# EAGLE design facetHound_inputs_chassis_v12 (EAGLE 9.6.2)

## Sheet 1 of 2
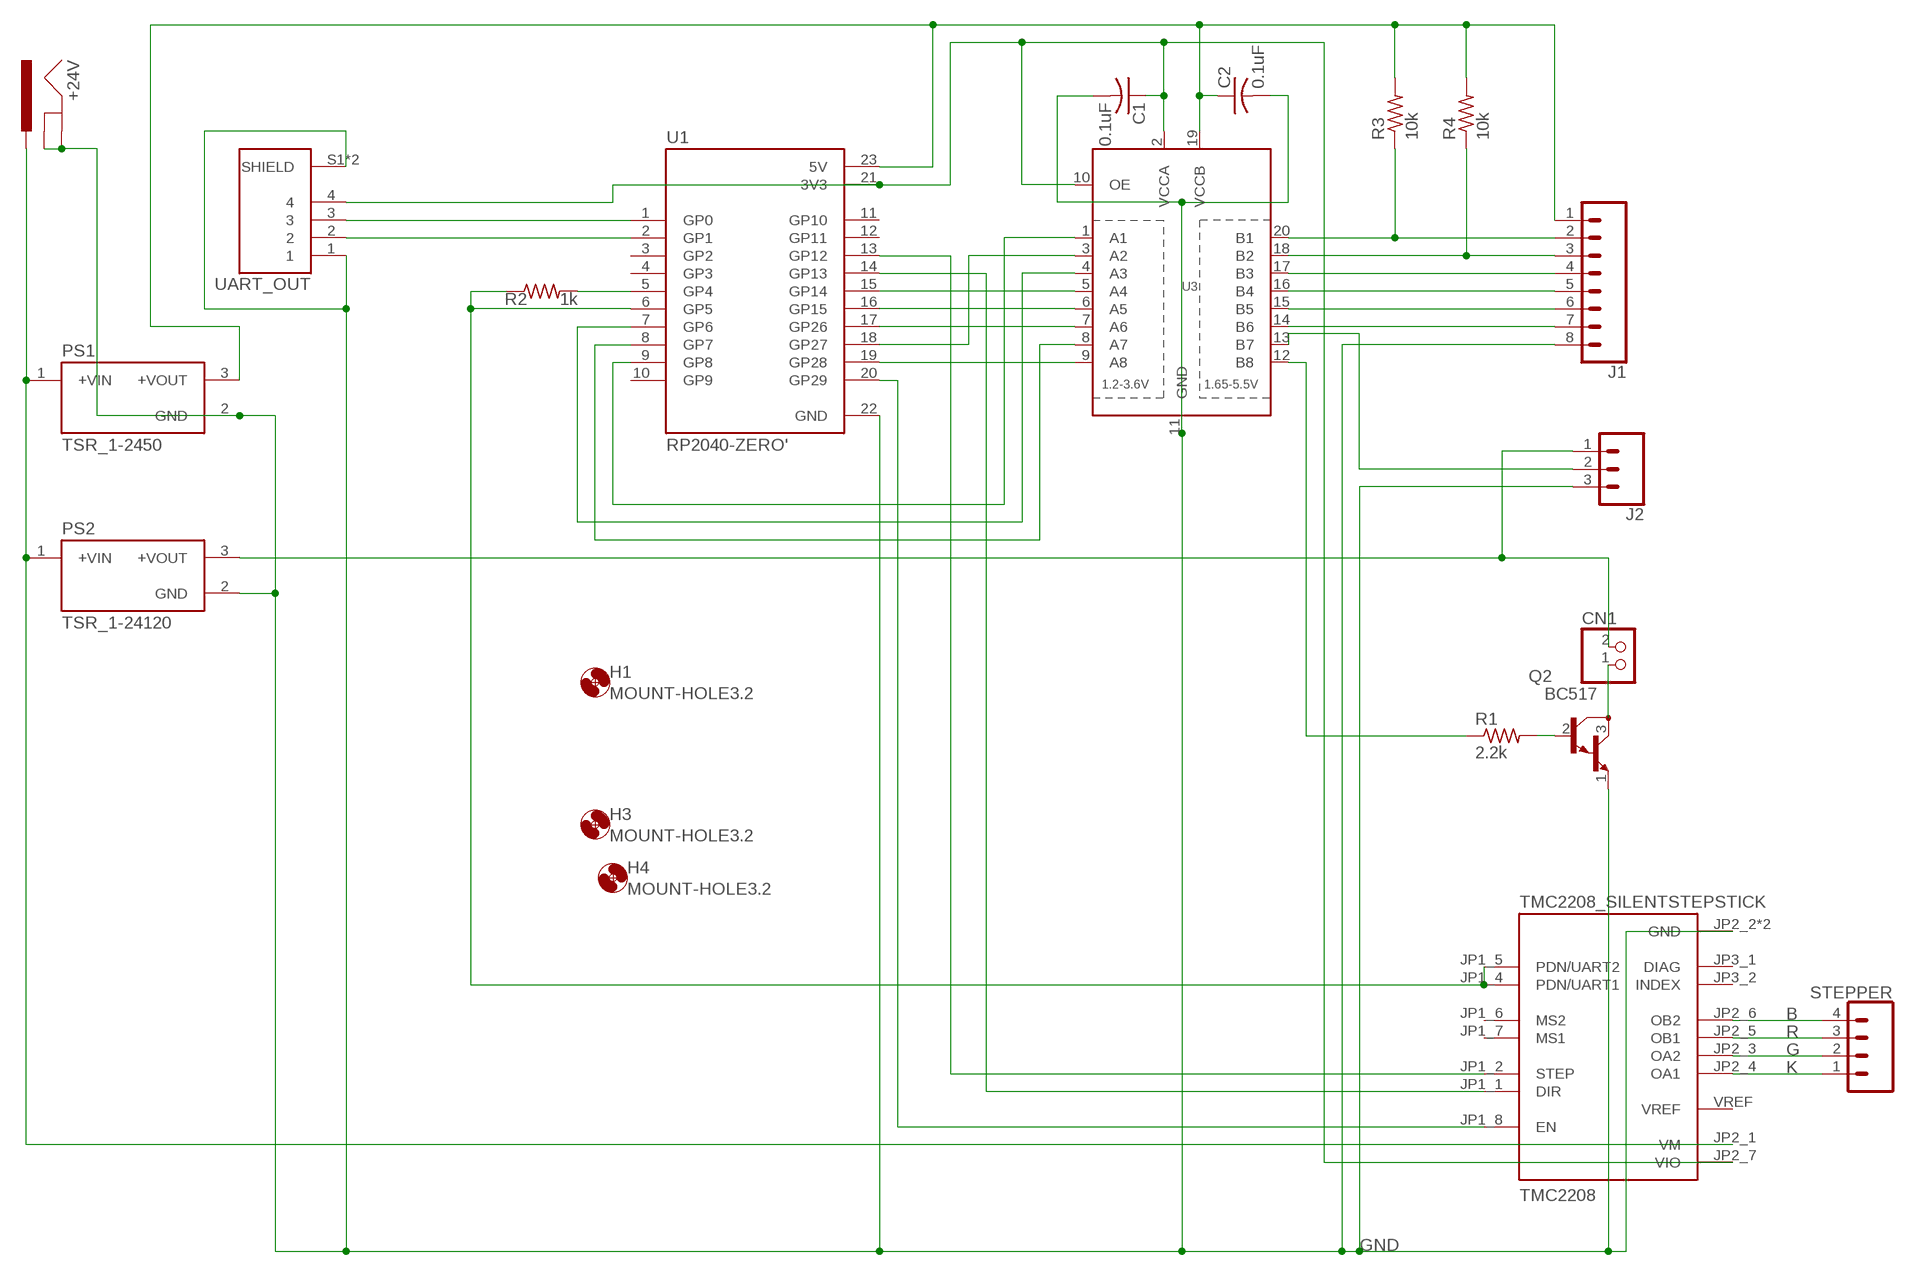
[diagram p0: schematic, sheet 1]

### Parts
+24V  POWER_JACKPOWER_JACK_SLOT  [POWER_JACK_PTH_SLOT]
C1  0.1uF  C-USC1206  [C1206]
C2  0.1uF  C-USC1206  [C1206]
CN1  JST_2PIN-THM-RA  [JST-PH-2-THM-RA]
H1  MOUNT-HOLE3.2  [3,2]
H3  MOUNT-HOLE3.2  [3,2]
H4  MOUNT-HOLE3.2  [3,2]
J1  CONN_08LONGPADS  [1X08_LONGPADS]
J2  CONN_03SCREW  [SCREWTERMINAL-3.5MM-3]
PS1  TSR_1-2450  [CONV_TSR_1-2450]
PS2  TSR_1-24120  TSR_1-2450  [CONV_TSR_1-2450]
Q2  BC517  [TO92]
R1  2.2k  R-US_M1206  [M1206]
R2  1k  R-US_R1206  [R1206]
R3  10k  R-US_M1206  [M1206]
R4  10k  R-US_M1206  [M1206]
STEPPER  CONN_04JST-PTH  [JST-4-PTH]
TMC2208  TMC2208_SILENTSTEPSTICK  [MODULE_TMC2208_SILENTSTEPSTICK]
U1  RP2040-ZERO'  [MODULE_RP2040-ZERO]
U3  TXB0108PWR  [TSSOP20]
UART_OUT  S4B-ZR-SM4A-TF(LF)(SN)  [JST_S4B-ZR-SM4A-TF(LF)(SN)]

### Nets
B: STEPPER.4 TMC2208.JP2_6(OB2)
G: STEPPER.2 TMC2208.JP2_3(OA2)
GND: +24V.GND +24V.GNDBREAK C1.2 C2.2 J1.8 J2.3 PS1.2(GND) PS2.2(GND) Q2.1(E) TMC2208.JP2_2(GND) TMC2208.JP2_8(GND) U1.22(GND) U3.11(GND) UART_OUT.1 UART_OUT.S1(SHIELD) UART_OUT.S2(SHIELD)
K: STEPPER.1 TMC2208.JP2_4(OA1)
N$1: R2.1 TMC2208.JP1_4(PDN/UART1) TMC2208.JP1_5(PDN/UART2) U1.6(GP5)
N$3: R2.2 U1.5(GP4)
N$4: C1.1 TMC2208.JP2_7(VIO) U1.21(3V3) U3.2(VCCA) U3.10(OE) UART_OUT.4
N$5: TMC2208.JP1_1(DIR) U1.14(GP13)
N$6: TMC2208.JP1_2(STEP) U1.13(GP12)
N$7: R1.1 U3.12(B8)
N$8: Q2.2(B) R1.2
N$9: C2.1 J1.1 PS1.3(+VOUT) R3.2 R4.2 U1.23(5V) U3.19(VCCB)
N$10: U1.2(GP1) UART_OUT.2
N$11: U1.1(GP0) UART_OUT.3
N$12: CN1.2 J2.1 PS2.3(+VOUT)
N$13: J1.2 R3.1 U3.20(B1)
N$14: J1.3 R4.1 U3.18(B2)
N$15: J1.4 U3.17(B3)
N$16: J1.5 U3.16(B4)
N$17: J1.6 U3.15(B5)
N$18: J1.7 U3.14(B6)
N$20: TMC2208.JP1_8(EN) U1.20(GP29)
N$21: +24V.PWR PS1.1(+VIN) PS2.1(+VIN) TMC2208.JP2_1(VM)
N$22: J2.2 U3.13(B7)
N$23: U1.9(GP8) U3.1(A1)
N$24: CN1.1 Q2.3(C)
N$25: U1.18(GP27) U3.3(A2)
N$26: U1.7(GP6) U3.4(A3)
N$27: U1.15(GP14) U3.5(A4)
N$28: U1.16(GP15) U3.6(A5)
N$29: U1.17(GP26) U3.7(A6)
N$30: U1.8(GP7) U3.8(A7)
N$31: U1.19(GP28) U3.9(A8)
R: STEPPER.3 TMC2208.JP2_5(OB1)
Unconnected: TMC2208.JP1_6(MS2) TMC2208.JP1_7(MS1) TMC2208.JP3_1(DIAG) TMC2208.JP3_2(INDEX) TMC2208.VREF U1.3(GP2) U1.4(GP3) U1.10(GP9) U1.11(GP10) U1.12(GP11)

## Sheet 2 of 2

## Library data of the parts
+24V = SparkFun-Connectors:POWER_JACK: Power Jack Connector This is the standard 5.5mm barrel jack for power. The PTH is the most common, proven, reliable, footprint. The Slot footprint only works if the mill layer is transmitted to the PCB fab house so be warned. Here are the connectors we sell at SparkFun: DC Barrel Power Jack/Connector <https://www.sparkfun.com/products/119> (PRT-00119) DC Barrel Power Jack/Connector (SMD) <https://www.sparkfun.com/products/12748> (PRT-12748) DC Barrel Jack Adapter - Breadboard Compatible <https://www.sparkfun.com/products/10811> (PRT-10811) It is used on this SparkFun product (and many, many others): SparkFun RedBoard - Programmed with Arduino <https://www.sparkfun.com/products/12757> (DEV-12757) Also, if you need a mating power supply or connector, please check these out: Wall Adapter Power Supply - 9VDC 650mA <https://www.sparkfun.com/products/298> (TOL-00298) DC Barrel Jack Adapter - Male <https://www.sparkfun.com/products/10287> (PRT-10287); PROD_ID: CONN-08197
C1 C2 = adafruit:C-US: CAPACITOR, American symbol
CN1 = adafruit:JST_2PIN: JST 2-Pin Connectors of various flavors SMT-RA (S2B-PH-SM4) 4UConnector #17311 SMT (B2B-PH-SM4) THM-RA (S2B-PH) THM (B2B-PH)
H1 H3 H4 = holes:MOUNT-HOLE: MOUNTING HOLE with drill center marker
J1 = SparkFun-Connectors:CONN_08: Multi connection point. Often used as Generic Header-pin footprint for 0.1 inch spaced/style header connections On any of the 0.1 inch spaced packages, you can populate with these: Break Away Headers - Straight <https://www.sparkfun.com/products/116> (PRT-00116) Break Away Male Headers - Right Angle <https://www.sparkfun.com/products/553> (PRT-00553) Female Headers <https://www.sparkfun.com/products/115> (PRT-00115) Break Away Headers - Machine Pin <https://www.sparkfun.com/products/117> (PRT-00117) Break Away Female Headers - Swiss Machine Pin <https://www.sparkfun.com/products/743> (PRT-00743) Arduino Stackable Header - 8 Pin <https://www.sparkfun.com/products/9279> (PRT-09279) For SCREWTERMINALS and SPRING TERMINALS visit here: Screw Terimnals on SparkFun.com <https://www.sparkfun.com/search/results?term=Screw+Terminals> (5mm/3.5mm/2.54mm spacing) This device is also useful as a general connection point to wire up your design to another part of your project. Our various solder wires solder well into these plated through hole pads. Hook-Up Wire - Assortment (Stranded, 22 AWG) <https://www.sparkfun.com/products/11375> (PRT-11375) Hook-Up Wire - Assortment (Solid Core, 22 AWG) <https://www.sparkfun.com/products/11367> (PRT-11367) View the entire wire category on our website here <https://www.sparkfun.com/categories/141> Special notes: Molex polarized connector foot print use with SKU : PRT-08231 with associated crimp pins and housings. 1MM SMD Version SKU: PRT-10208 NOTES ON THE VARIANTS LOCK and LOCK_LONGPADS... This footprint was designed to help hold the alignment of a through-hole component (i.e. 6-pin header) while soldering it into place. You may notice that each hole has been shifted either up or down by 0.005 of an inch from it's more standard position (which is a perfectly straight line). This slight alteration caused the pins (the squares in the middle) to touch the edges of the holes. Because they are alternating, it causes a "brace" to hold the component in place. 0.005 has proven to be the perfect amount of "off-center" position when using our standard breakaway headers. Although looks a little odd when you look at the bare footprint, once you have a header in there, the alteration is very hard to notice. Also,if you push a header all the way into place, it is covered up entirely on the bottom side.
J2 = SparkFun-Connectors:CONN_03: Multi connection point. Often used as Generic Header-pin footprint for 0.1 inch spaced/style header connections On any of the 0.1 inch spaced packages, you can populate with these: Break Away Headers - Straight <https://www.sparkfun.com/products/116> (PRT-00116) Break Away Male Headers - Right Angle <https://www.sparkfun.com/products/553> (PRT-00553) Female Headers <https://www.sparkfun.com/products/115> (PRT-00115) Break Away Headers - Machine Pin <https://www.sparkfun.com/products/117> (PRT-00117) Break Away Female Headers - Swiss Machine Pin <https://www.sparkfun.com/products/743> (PRT-00743) Stackable Header - 3 Pin (Female, 0.1") <https://www.sparkfun.com/products/13875> (PRT-13875) For SCREWTERMINALS and SPRING TERMINALS visit here: Screw Terimnals on SparkFun.com <https://www.sparkfun.com/search/results?term=Screw+Terminals> (5mm/3.5mm/2.54mm spacing) This device is also useful as a general connection point to wire up your design to another part of your project. Our various solder wires solder well into these plated through hole pads. Hook-Up Wire - Assortment (Stranded, 22 AWG) <https://www.sparkfun.com/products/11375> (PRT-11375) Hook-Up Wire - Assortment (Solid Core, 22 AWG) <https://www.sparkfun.com/products/11367> (PRT-11367) View the entire wire category on our website here <https://www.sparkfun.com/categories/141> Special notes: Molex polarized connector foot print use with SKU : PRT-08232 with associated crimp pins and housings.; PROD_ID: CONN-08288; SF_ID: PRT-08235
PS1 PS2 = TSR_1-2450:TSR_1-2450; MANUFACTURER: Traco Power; MAXIMUM_PACKAGE_HEIGHT: 10.6mm; PARTREV: Apr 27, 2020; STANDARD: Manufacturer Recommendations
Q2 = transistor-npn:BC517*: NPN Darlington Transistor
R1-R4 = adafruit:R-US_: RESISTOR, American symbol
STEPPER = SparkFun-Connectors:CONN_04: Multi connection point. Often used as Generic Header-pin footprint for 0.1 inch spaced/style header connections On any of the 0.1 inch spaced packages, you can populate with these: Break Away Headers - Straight <https://www.sparkfun.com/products/116> (PRT-00116) Break Away Male Headers - Right Angle <https://www.sparkfun.com/products/553> (PRT-00553) Female Headers <https://www.sparkfun.com/products/115> (PRT-00115) Break Away Headers - Machine Pin <https://www.sparkfun.com/products/117> (PRT-00117) Break Away Female Headers - Swiss Machine Pin <https://www.sparkfun.com/products/743> (PRT-00743) For SCREWTERMINALS and SPRING TERMINALS visit here: Screw Terimnals on SparkFun.com <https://www.sparkfun.com/search/results?term=Screw+Terminals> (5mm/3.5mm/2.54mm spacing) This device is also useful as a general connection point to wire up your design to another part of your project. Our various solder wires solder well into these plated through hole pads. Hook-Up Wire - Assortment (Stranded, 22 AWG) <https://www.sparkfun.com/products/11375> (PRT-11375) Hook-Up Wire - Assortment (Solid Core, 22 AWG) <https://www.sparkfun.com/products/11367> (PRT-11367) View the entire wire category on our website here <https://www.sparkfun.com/categories/141> Special notes: Molex polarized connector foot print use with SKU : PRT-08231 with associated crimp pins and housings. 1MM SMD Version SKU: PRT-10208; PROD_ID: WIRE-13531; SF_ID: PRT-09916
TMC2208 = TMC2208_SILENTSTEPSTICK:TMC2208_SILENTSTEPSTICK: Check availability <https://pricing.snapeda.com/parts/TMC2208%20SILENTSTEPSTICK/Trinamic%20Motion/view-part?ref=eda>; AVAILABILITY: In Stock; CHECK_PRICES: https://www.snapeda.com/parts/TMC2208%20SILENTSTEPSTICK/Trinamic/view-part/?ref=eda; DESCRIPTION: TMC2208 Motor Controller/Driver, Stepper Power Management Evaluation Board; MF: Trinamic Motion; MP: TMC2208 SILENTSTEPSTICK; PACKAGE: None; PRICE: None; SNAPEDA_LINK: https://www.snapeda.com/parts/TMC2208%20SILENTSTEPSTICK/Trinamic/view-part/?ref=snap
U1 = RP2040-ZERO:RP2040-ZERO: Check availability <https://pricing.snapeda.com/parts/RP2040-ZERO/Waveshare%20Electronics/view-part?ref=eda>; AVAILABILITY: Not in stock; CHECK_PRICES: https://www.snapeda.com/parts/RP2040-ZERO/Waveshare+Electronics/view-part/?ref=eda; DESCRIPTION: Low-Cost, High-Performance Pico-Like MCU Board Based On Raspberry Pi Microcontroller RP2040; MF: Waveshare Electronics; MP: RP2040-ZERO; PACKAGE: Package; PRICE: None; SNAPEDA_LINK: https://www.snapeda.com/parts/RP2040-ZERO/Waveshare+Electronics/view-part/?ref=snap
U3 = adafruit:TXB0108PWR: 8-Bit Bi-Directional Level Shifter 1.2V-3.6V (VCCA) to 1.65V-5.5V (VCCB) bi-directional level shifter with auto direction sensing. Max data rate - VCCA 1.8V: 20Mbps (50ns), VCCA 3.3V: 100Mbps (10ns) Digikey: 296-21527-1-ND
UART_OUT = S4B-ZR-SM4A-TF_LF__SN_:S4B-ZR-SM4A-TF(LF)(SN): Check availability <https://pricing.snapeda.com/parts/S4B-ZR-SM4A-TF%28LF%29%28SN%29/JST%20Sales/view-part?ref=eda>; AVAILABILITY: In Stock; CHECK_PRICES: https://www.snapeda.com/parts/S4B-ZR-SM4A-TF(LF)(SN)/JST/view-part/?ref=eda; DESCRIPTION: Connector Header Surface Mount, Right Angle 4 position 0.059 (1.50mm); MF: JST Sales; MP: S4B-ZR-SM4A-TF(LF)(SN); PACKAGE: None; PRICE: None; SNAPEDA_LINK: https://www.snapeda.com/parts/S4B-ZR-SM4A-TF(LF)(SN)/JST/view-part/?ref=snap

## Board
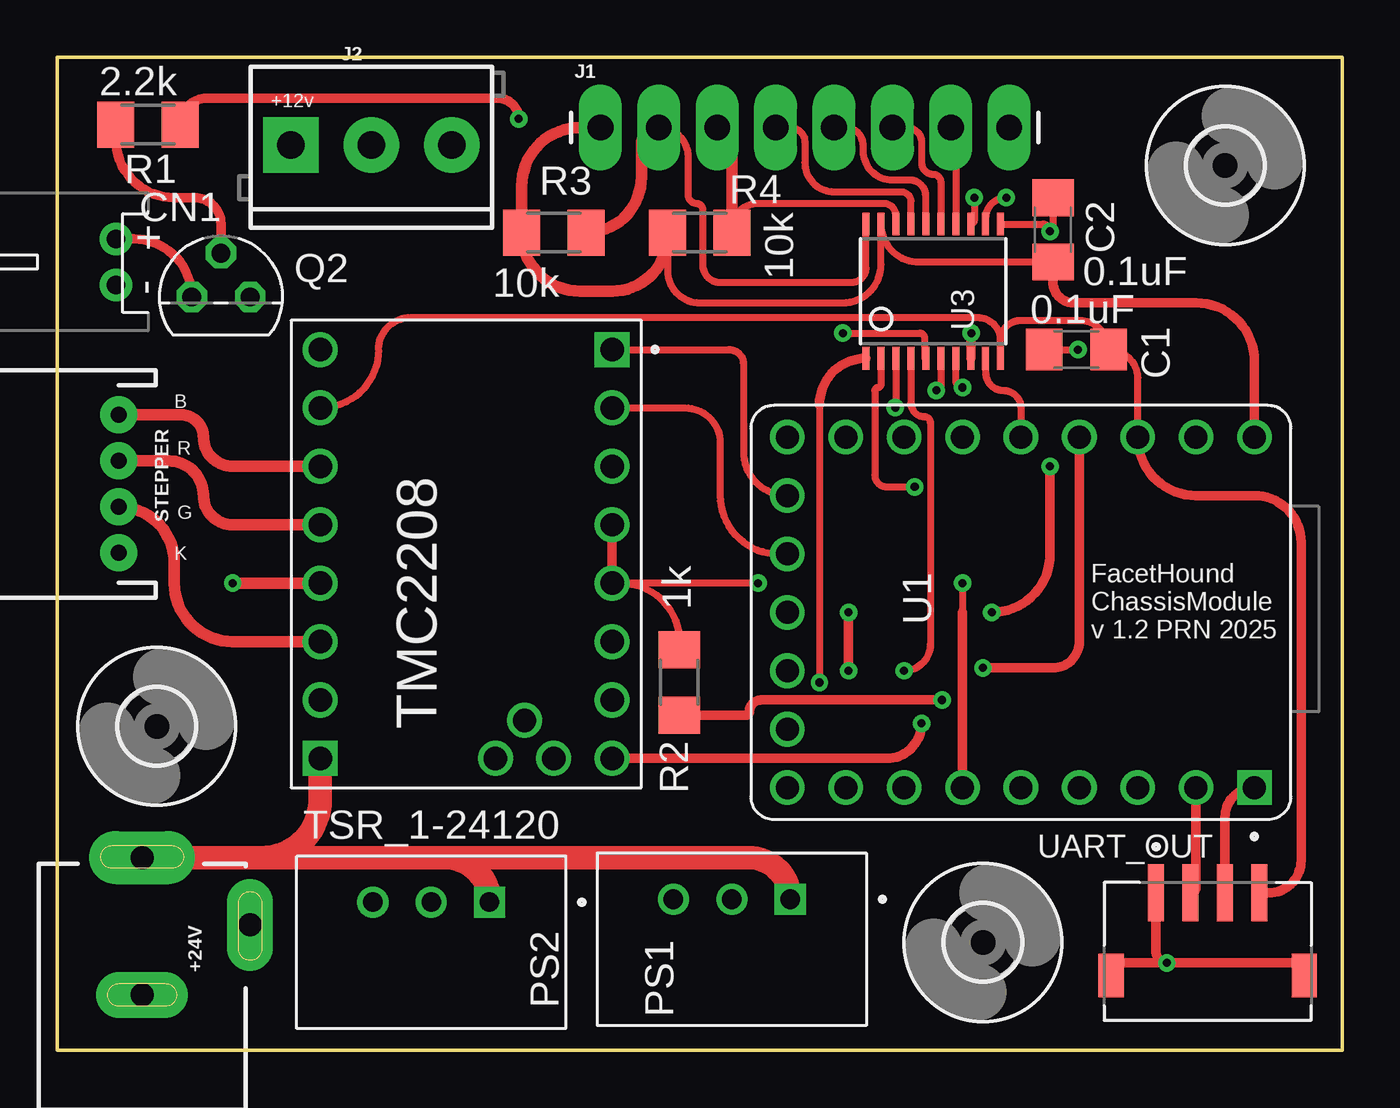
[diagram p1: board, top side]
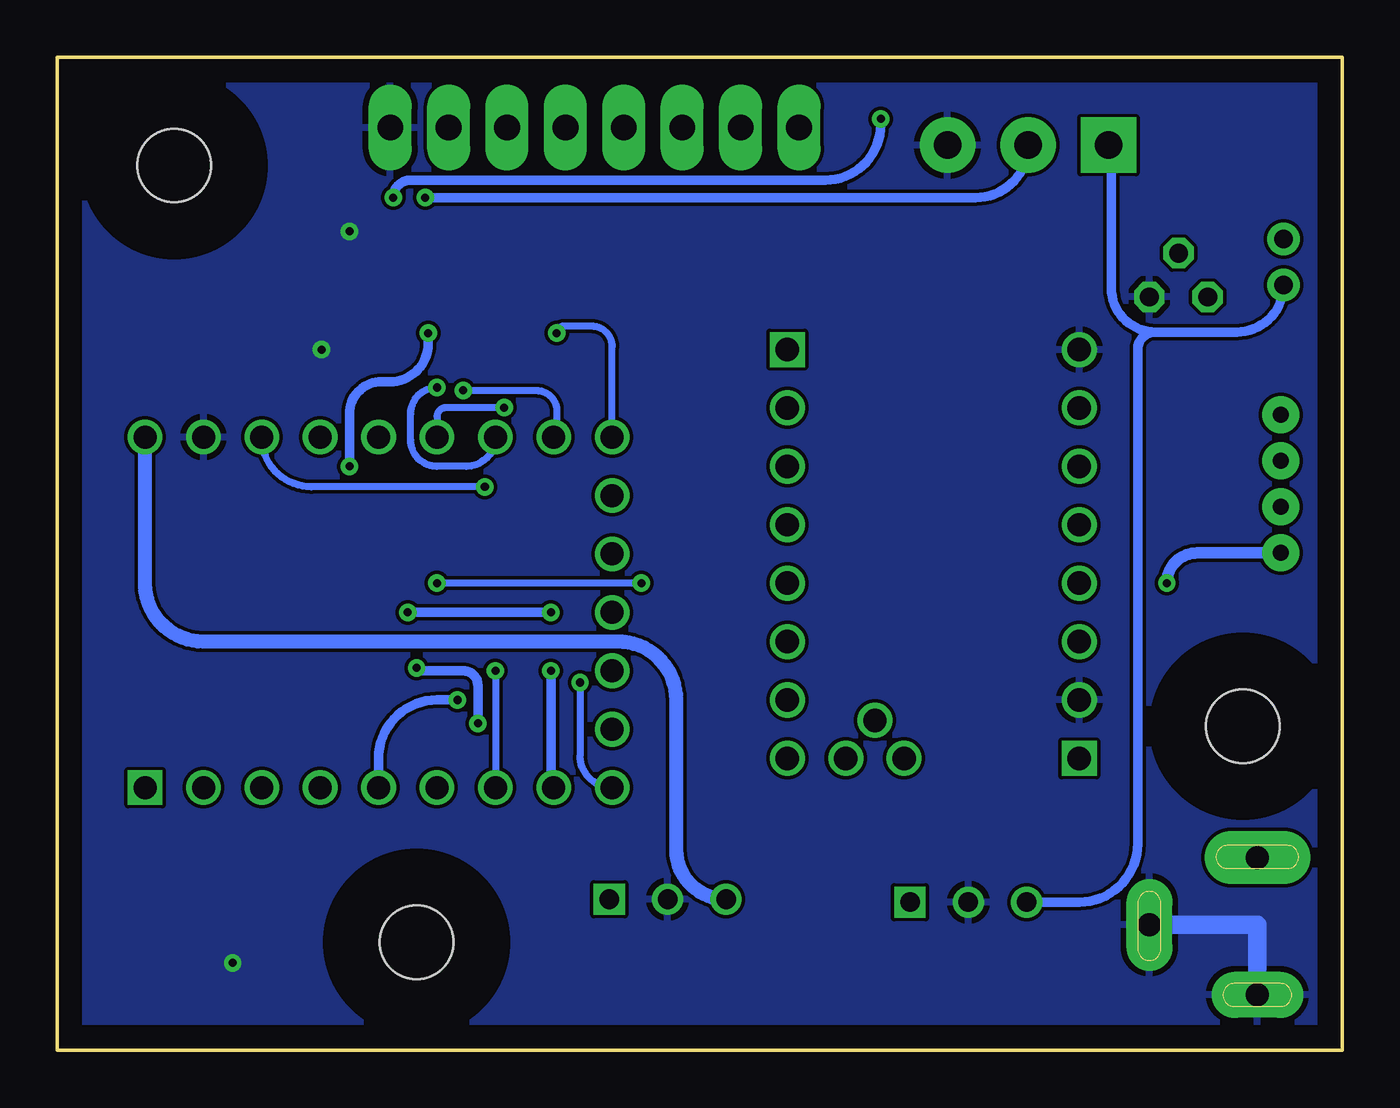
[diagram p2: board, bottom side, seen from below]

Size 55.88 x 43.18 mm. Coordinates in mm from the lower left corner, seen from the top.
Outline: 0,43.18 0,0 55.88,0 55.88,43.18 0,43.18
Copper layers (1*16): Top 0.035mm / dielectric 1.5mm / Bottom 0.035mm
Design rules "default": minimum track width 6mil, minimum drill 0.35mm, track to track 6mil, track to pad 6mil, pad to pad 6mil, via to via 6mil, smd to smd 6mil, copper to edge 40mil, drill to drill 6mil, minimum pad ring 10mil, minimum via ring 8mil, stop-mask expansion 4mil, vias tented up to drill 0mil, thermal gap 10mil

### Footprints (pad centres in the part's own frame; a part is rotated, then mirrored left to right if it is on the bottom)
POWER_JACK_PTH_SLOT = drill 1 pad 2 long: GND 0,0; GNDBREAK -3.048,4.699 | drill 1 pad 2.3 long: PWR -5.969,0
C1206 = smd 1.6 x 1.8: 1 -1.4,0; 2 1.4,0
JST-PH-2-THM-RA = drill 0.8 pad 1.422: 1 1,0; 2 -1,0
3,2 = hole 3.2: 0,0
1X08_LONGPADS = drill 1.118 pad 1.88 long: 1 0,0; 2 2.54,0; 3 5.08,0; 4 7.62,0; 5 10.16,0; 6 12.7,0; 7 15.24,0; 8 17.78,0
SCREWTERMINAL-3.5MM-3 = drill 1.2 pad 2.413 square: 1 0,0 | drill 1.2 pad 2.413: 2 3.5,0; 3 7,0
CONV_TSR_1-2450 = drill 0.85 square: 1 -2.54,-1.75 | drill 0.85: 2 0,-1.75; 3 2.54,-1.75
TO92 = drill 0.813 octagon: 1 1.27,0; 2 0,1.905; 3 -1.27,0
M1206 = smd 1.6 x 2: 1 -1.4,0; 2 1.4,0
R1206 = smd 1.6 x 1.803: 1 -1.422,0; 2 1.422,0
JST-4-PTH = drill 0.7 pad 1.6: 1 -3,0; 2 -1,0; 3 1,0; 4 3,0
MODULE_TMC2208_SILENTSTEPSTICK = drill 1.016 square: JP1_1 6.35,8.89; JP2_1 -6.35,-8.89 | drill 1.016: JP1_2 6.35,6.35; JP1_3 6.35,3.81; JP1_4 6.35,1.27; JP1_5 6.35,-1.27; JP1_6 6.35,-3.81; JP1_7 6.35,-6.35; JP1_8 6.35,-8.89; JP2_2 -6.35,-6.35; JP2_3 -6.35,-3.81; JP2_4 -6.35,-1.27; JP2_5 -6.35,1.27; JP2_6 -6.35,3.81; JP2_7 -6.35,6.35; JP2_8 -6.35,8.89; JP3_1 1.27,-8.89; JP3_2 3.81,-8.89; VREF 2.54,-7.239
MODULE_RP2040-ZERO = drill 1 square: 1 7.62,10.16 | drill 1: 2 7.62,7.62; 3 7.62,5.08; 4 7.62,2.54; 5 7.62,0; 6 7.62,-2.54; 7 7.62,-5.08; 8 7.62,-7.62; 9 7.62,-10.16; 10 5.08,-10.16; 11 2.54,-10.16; 12 0,-10.16; 13 -2.54,-10.16; 14 -5.08,-10.16; 15 -7.62,-10.16; 16 -7.62,-7.62; 17 -7.62,-5.08; 18 -7.62,-2.54; 19 -7.62,0; 20 -7.62,2.54; 21 -7.62,5.08; 22 -7.62,7.62; 23 -7.62,10.16
TSSOP20 = smd 0.305 x 0.991: 1 -2.925,-2.918; 2 -2.275,-2.918; 3 -1.625,-2.918; 4 -0.975,-2.918; 5 -0.325,-2.918; 6 0.325,-2.918; 7 0.975,-2.918; 8 1.625,-2.918; 9 2.275,-2.918; 10 2.925,-2.918; 11 2.925,2.918; 12 2.275,2.918; 13 1.625,2.918; 14 0.975,2.918; 15 0.325,2.918; 16 -0.325,2.918; 17 -0.975,2.918; 18 -1.625,2.918; 19 -2.275,2.918; 20 -2.925,2.918
JST_S4B-ZR-SM4A-TF(LF)(SN) = smd 0.7 x 2.5: 1 -2.25,0; 2 -0.75,0; 3 0.75,0; 4 2.25,0 | smd 1.1 x 1.9: S1 -4.2,-3.6; S2 4.2,-3.6

### Placement (x,y rotation side)
+24V  3.68,2.41 270 top
C1  44.32,30.48 180 top
C2  43.31,35.69 90 top
CN1  2.54,34.29 90 top
H1  4.32,14.1 0 top
H3  50.8,38.48 0 top
H4  40.26,4.7 0 top
J1  23.62,40.13 0 top
J2  10.16,39.37 0 top
PS1  29.34,4.83 180 top
PS2  16.26,4.7 180 top
Q2  7.11,32.77 0 top
R1  3.94,40.26 180 top
R2  27.05,16 270 top
R3  21.59,35.56 180 top
R4  27.94,35.56 180 top
STEPPER  2.67,24.64 90 top
TMC2208  17.78,21.59 0 top
U1  41.91,19.05 270 top
U3  38.1,33.02 0 top
UART_OUT  50.04,6.86 0 top

### Tracks (layer width: path | path; a pad name or v marks a point on that pad's centre or on a via)
B
  Top 0.508: TMC2208.JP2_6 7.62,25.4 arc-90 6.35,26.67 arc90 5.38,27.64 STEPPER.4
G
  Top 0.508: STEPPER.2 arc-90 5.08,21.23 5.08,20.32 arc90 7.62,17.78 TMC2208.JP2_3
GND  (via drill 0.35)
  Top 0.305: C1.2 v44.39,30.48 | C2.2 43.31,35.75 arc-90 v43.18,35.62 arc90 42.86,35.94 U3.11
  Top 0.406: UART_OUT.1 47.79,4.28 arc90 v48.26,3.81 | UART_OUT.S1 arc-90 46.39,3.81 v48.26,3.81 | v48.26,3.81 53.69,3.81 arc-90 UART_OUT.S2
  Bottom 0.813: +24V.GND 3.68,5.46 +24V.GNDBREAK
  pour Bottom: 0,43.18 55.88,43.18 55.88,27.94 55.88,0 52.07,0 0,0 0,3.81
K  (via drill 0.35)
  Top 0.508: v7.62,20.32 TMC2208.JP2_4
  Bottom 0.508: STEPPER.1 6.3,21.64 arc-90 v7.62,20.32
N$1  (via drill 0.35)
  Top 0.305: TMC2208.JP1_5 24.51,20.32 | 24.51,20.32 arc-90 27.05,17.78 R2.1 | v30.48,20.32 24.51,20.32 | v39.37,20.32 39.37,19.05
  Top 0.406: 39.37,19.05 U1.6 | TMC2208.JP1_4 TMC2208.JP1_5
  Bottom 0.305: v30.48,20.32 v39.37,20.32
N$3  (via drill 0.35)
  Top 0.406: R2.2 29.95,14.58 arc90 30.1,14.73 arc-90 30.61,15.24 v38.48,15.24
  Bottom 0.406: v38.48,15.24 39.37,15.24 arc-90 41.91,12.7 U1.5
N$4  (via drill 0.35)
  Top 0.305: U1.21 46.99,29.21 arc90 C1.1 arc90 44.45,31.75 41.91,31.75 arc90 41.02,30.87 | TMC2208.JP2_7 arc90 13.97,30.48 arc-90 15.37,31.88 40.01,31.88 arc-90 41.02,30.87 | 41.02,30.55 U3.10 41.02,30.87 | U3.2 35.83,28.97 arc-90 35.69,28.83 arc90 35.56,28.7 35.56,25.02 arc90 36.07,24.51 v37.29,24.51
  Top 0.406: U1.21 arc90 49.53,24.13 52.07,24.13 arc-90 54.1,22.1 54.1,8.26 arc-90 52.7,6.86 UART_OUT.4 | 45.72,30.6 C1.1
  Bottom 0.305: v37.29,24.51 44.83,24.51 arc90 U1.21
N$5
  Top 0.305: TMC2208.JP1_1 29.21,30.48 arc-90 29.84,29.84 29.84,26.04 arc90 U1.14
N$6
  Top 0.305: TMC2208.JP1_2 27.3,27.94 arc-90 28.83,26.42 28.83,24.13 arc90 31.37,21.59 U1.13
N$7  (via drill 0.35)
  Top 0.305: v41.27,37.08 arc90 40.38,36.18 U3.12
  Top 0.406: R1.1 arc-90 6.48,41.4 19.18,41.4 arc-90 v20.07,40.51
  Bottom 0.406: v20.07,40.51 20.07,40.26 arc90 22.48,37.85 40.51,37.85 arc-90 v41.27,37.08
N$8
  Top 0.406: R1.2 2.54,39.62 arc90 5.08,37.08 5.97,37.08 arc-90 7.11,35.94 Q2.2
N$9
  Top 0.305: R4.2 26.54,33.91 arc90 27.94,32.51 34.16,32.51 arc90 35.83,34.17 U3.19 arc90 37.48,34.29 C2.1
  Top 0.406: C2.1 43.31,33.4 arc90 44.2,32.51 49.53,32.51 arc-90 52.07,29.97 U1.23
  Top 0.508: J1.1 22.73,40.13 arc90 20.19,37.59 R3.2 arc90 22.73,33.02 24.13,33.02 arc90 26.54,35.43 R4.2
  Top 0.61: 26.67,35.43 arc90 R4.2
  Bottom 0.61: U1.23 52.07,23.37 52.07,22.86 52.07,20.32 arc-90 49.53,17.78 31.5,17.78 arc90 28.96,15.24 28.96,8.73 arc-90 PS1.3
N$10
  Top 0.406: UART_OUT.2 arc90 49.53,7.1 U1.2
N$11
  Top 0.406: UART_OUT.3 50.79,10.15 arc-90 U1.1
N$12
  Bottom 0.406: PS2.3 11.43,6.45 arc-90 8.89,8.99 8.89,30.48 arc90 8.13,31.24 | CN1.2 arc90 4.59,31.24 8.13,31.24 | 8.13,31.24 arc90 10.03,33.15 10.03,39.24 arc-90 J2.1
N$13
  Top 0.305: J1.2 arc-90 27.43,38.86 27.43,37.21 arc90 27.81,36.83 arc-90 28.07,36.58 28.07,34.16 arc90 28.83,33.4 34.54,33.4 arc90 35.18,34.03 U3.20
  Top 0.508: R3.1 arc90 25.4,37.97 25.4,39.37 arc-90 J1.2
N$14
  Top 0.305: U3.18 36.48,36.3 arc90 35.94,36.83 30.48,36.83 arc90 29.34,35.69 R4.1
  Top 0.508: R4.1 29.34,39.49 arc90 J1.3
N$15
  Top 0.305: U3.17 37.12,36.92 arc90 36.7,37.34 33.78,37.34 arc-90 32.51,38.61 32.51,39.5 arc90 31.88,40.13 J1.4
N$16
  Top 0.305: U3.16 37.77,37.16 arc90 37.08,37.85 36.32,37.85 arc-90 35.05,39.12 35.05,39.37 arc90 34.29,40.13 J1.5
N$17
  Top 0.305: J1.6 36.96,40.13 arc-90 37.59,39.5 37.59,38.61 arc90 38.1,38.1 arc-90 38.43,37.77 U3.15
N$18
  Top 0.305: J1.7 arc-90 39.08,39.92 U3.14
N$20  (via drill 0.35)
  Top 0.406: TMC2208.JP1_8 36.07,12.7 arc90 v37.59,14.22 | v40.26,16.64 43.31,16.64 arc90 44.45,17.78 U1.20
  Bottom 0.406: v37.59,14.22 37.59,15.87 arc-90 38.23,16.51 40.13,16.51 arc90 v40.26,16.64
N$21
  Top 1.016: TMC2208.JP2_1 11.43,10.92 arc-90 8.89,8.38 +24V.PWR 16.51,8.38 16.86,8.38 | 16.86,8.38 arc-90 PS2.1 | 16.86,8.38 30.07,8.38 arc-90 PS1.1
N$22  (via drill 0.35)
  Top 0.305: v39.88,37.08 39.88,36.09 arc-90 U3.13
  Bottom 0.406: J2.2 arc90 15.95,37.08 v39.88,37.08
N$23  (via drill 0.35)
  Top 0.305: 33.15,28.07 v33.15,16
  Top 0.406: U3.1 arc90 33.15,28.07
  Bottom 0.305: v33.15,16 33.15,12.83 arc-90 U1.9
N$24
  Top 0.406: 2.81,35.56 arc90 CN1.1 3.32,35.29 arc-90 Q2.3
N$25  (via drill 0.35)
  Top 0.305: U3.3 36.48,27.98 arc-90 v36.45,27.95
  Bottom 0.305: v36.45,27.95 38.97,27.95 arc-90 39.37,27.56 U1.18
N$26  (via drill 0.35)
  Top 0.305: U3.4 37.12,28.15 arc90 37.72,27.56 arc-90 37.97,27.3 37.97,17.65 arc-90 v36.83,16.51
  Bottom 0.305: v36.83,16.51 U1.7
N$27  (via drill 0.35)
  Top 0.305: U3.5 arc-90 37.72,30.16 37.72,30.99 arc90 37.51,31.19 v34.16,31.19
  Bottom 0.305: v34.16,31.19 arc90 33.86,31.5 32.64,31.5 arc90 31.75,30.61 U1.15
N$28  (via drill 0.35)
  Top 0.305: U3.6 38.43,28.9 arc-90 v38.23,28.7
  Bottom 0.305: v38.23,28.7 35.05,28.7 arc90 34.16,27.81 34.16,26.8 arc90 U1.16
N$29  (via drill 0.35)
  Top 0.305: v39.37,28.83 arc-90 39.08,29.12 U3.7
  Bottom 0.305: U1.17 arc90 38.1,25.4 39.37,25.4 arc90 40.51,26.54 40.51,27.69 arc90 v39.37,28.83
N$30  (via drill 0.35)
  Top 0.406: U3.8 39.73,31.17 arc-90 v39.75,31.19 | v43.18,25.4 43.18,21.59 arc-90 v40.64,19.05 | v34.42,19.05 v34.42,16.51
  Bottom 0.406: v39.75,31.19 39.75,30.73 arc90 41.4,29.08 41.78,29.08 arc-90 43.18,27.69 v43.18,25.4 | v40.64,19.05 v34.42,19.05 | v34.42,16.51 34.42,11.56 arc-90 U1.8
N$31
  Top 0.305: U3.9 40.38,29.48 arc90 41.15,28.7 arc-90 41.91,27.94 U1.19
R
  Top 0.508: STEPPER.3 4.84,25.64 arc-90 6.35,24.13 arc90 7.62,22.86 TMC2208.JP2_5

### Text on the board
tNames: +12v | B | R | G | K | FacetHound / ChassisModule / v 1.2 PRN 2025